# EAGLE design W103C (EAGLE 6.6.0)
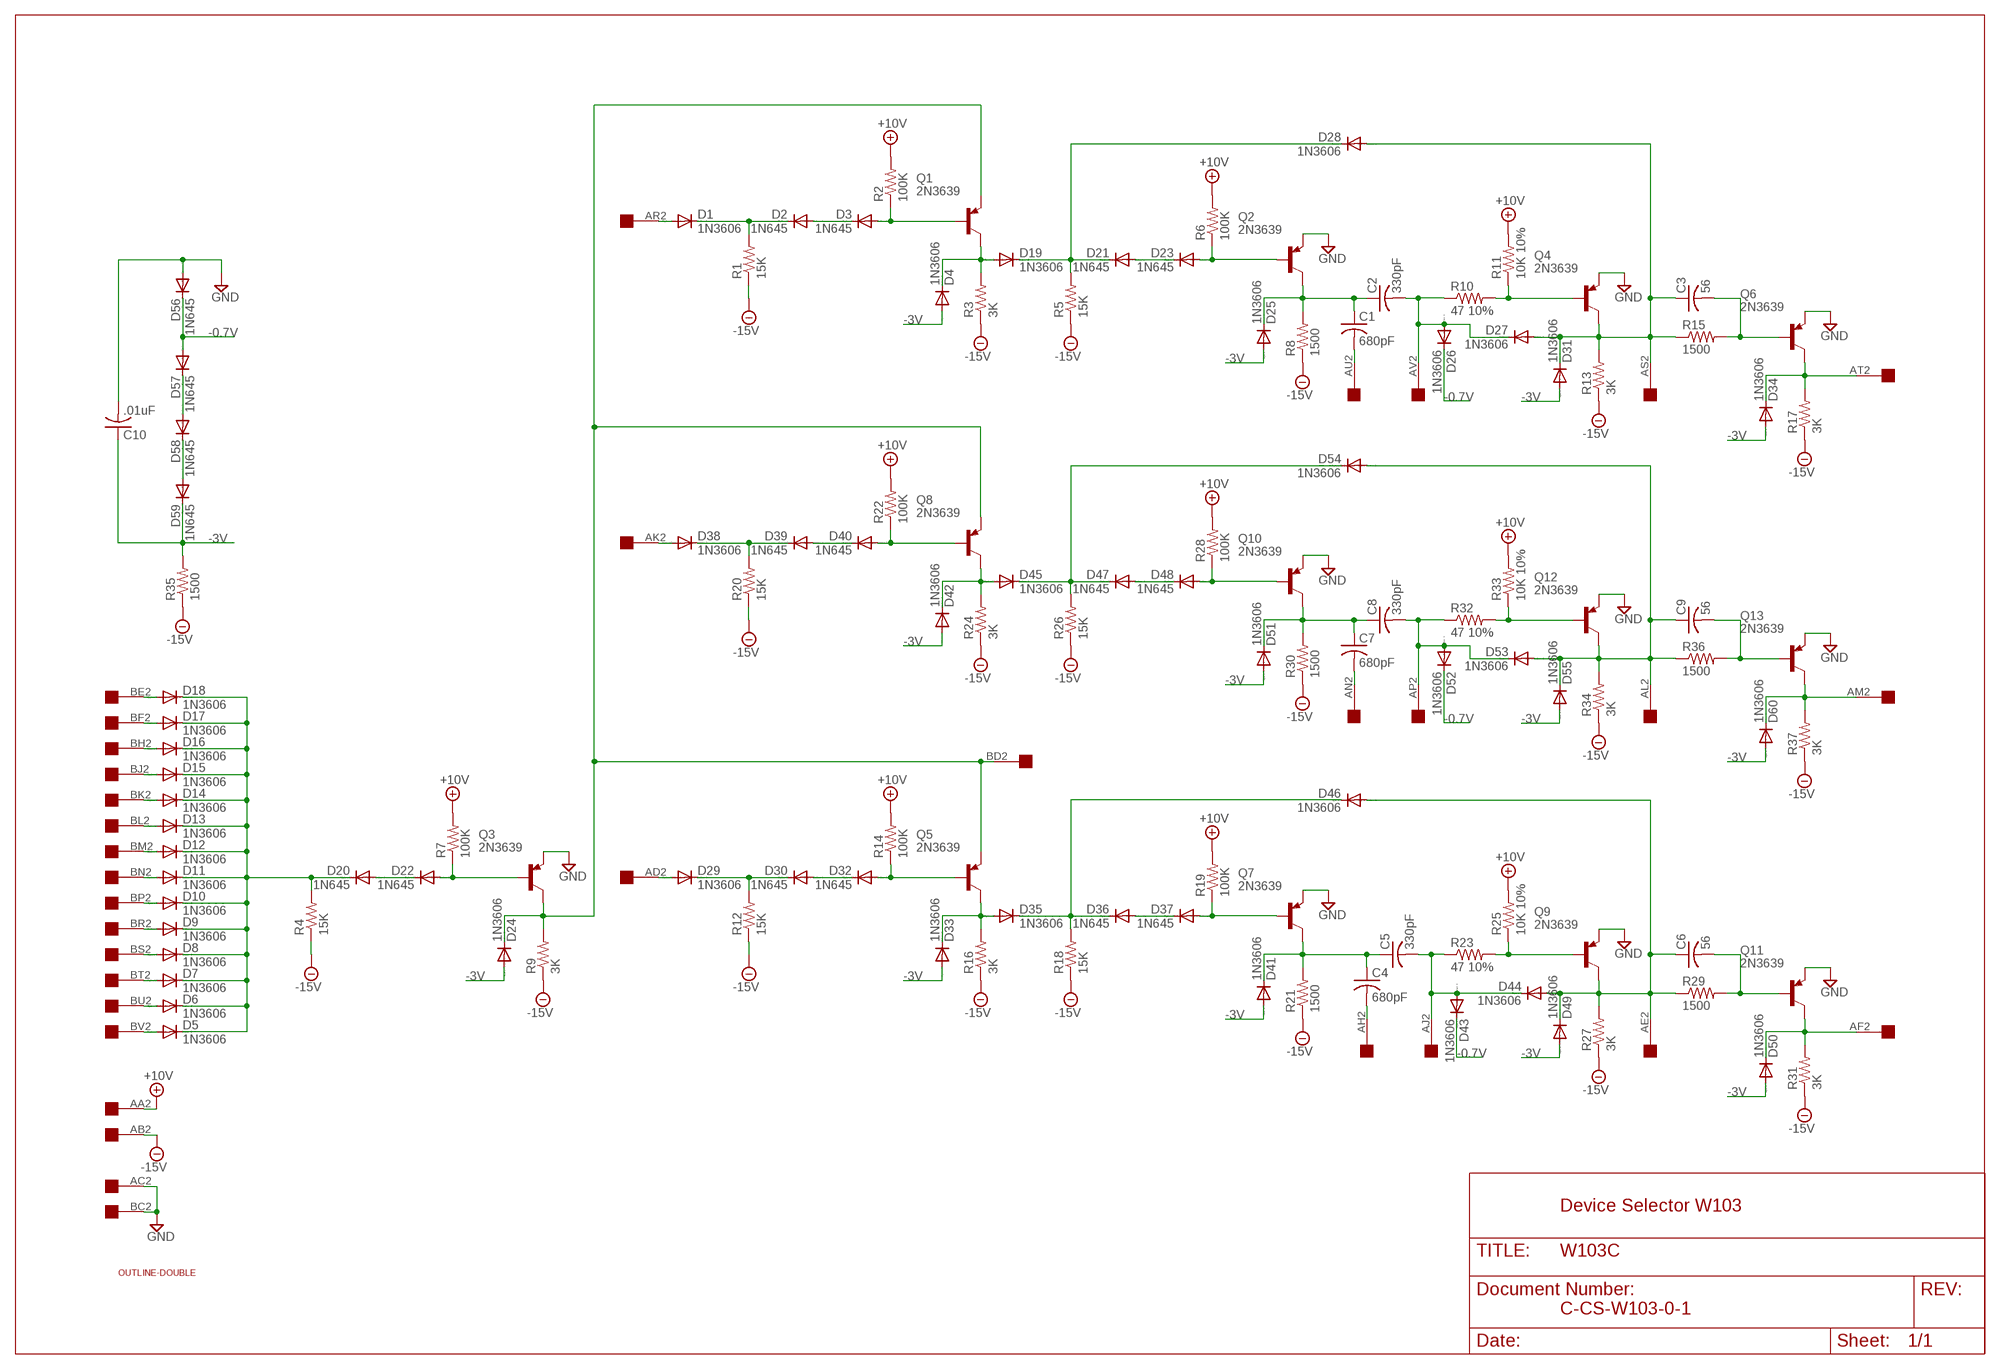
[diagram p0: schematic, sheet 1]

## Parts
C1  680pF  C-US075-032X103  [C075-032X103]
C2  330pF  C-US075-032X103  [C075-032X103]
C3  56  C-US075-032X103  [C075-032X103]
C4  680pF  C-US075-032X103  [C075-032X103]
C5  330pF  C-US075-032X103  [C075-032X103]
C6  56  C-US075-032X103  [C075-032X103]
C7  680pF  C-US075-032X103  [C075-032X103]
C8  330pF  C-US075-032X103  [C075-032X103]
C9  56  C-US075-032X103  [C075-032X103]
C10  .01uF  C-US075-032X103  [C075-032X103]
D1  1N3606  1N4148DO35-10  [DO35-10]
D2  1N645  1N4148DO35-10  [DO35-10]
D3  1N645  1N4148DO35-10  [DO35-10]
D4  1N3606  1N4148DO35-10  [DO35-10]
D5  1N3606  1N4148DO35-10  [DO35-10]
D6  1N3606  1N4148DO35-10  [DO35-10]
D7  1N3606  1N4148DO35-10  [DO35-10]
D8  1N3606  1N4148DO35-10  [DO35-10]
D9  1N3606  1N4148DO35-10  [DO35-10]
D10  1N3606  1N4148DO35-10  [DO35-10]
D11  1N3606  1N4148DO35-10  [DO35-10]
D12  1N3606  1N4148DO35-10  [DO35-10]
D13  1N3606  1N4148DO35-10  [DO35-10]
D14  1N3606  1N4148DO35-10  [DO35-10]
D15  1N3606  1N4148DO35-10  [DO35-10]
D16  1N3606  1N4148DO35-10  [DO35-10]
D17  1N3606  1N4148DO35-10  [DO35-10]
D18  1N3606  1N4148DO35-10  [DO35-10]
D19  1N3606  1N4148DO35-10  [DO35-10]
D20  1N645  1N4148DO35-10  [DO35-10]
D21  1N645  1N4148DO35-10  [DO35-10]
D22  1N645  1N4148DO35-10  [DO35-10]
D23  1N645  1N4148DO35-10  [DO35-10]
D24  1N3606  1N4148DO35-10  [DO35-10]
D25  1N3606  1N4148DO35-10  [DO35-10]
D26  1N3606  1N4148DO35-10  [DO35-10]
D27  1N3606  1N4148DO35-10  [DO35-10]
D28  1N3606  1N4148DO35-10  [DO35-10]
D29  1N3606  1N4148DO35-10  [DO35-10]
D30  1N645  1N4148DO35-10  [DO35-10]
D31  1N3606  1N4148DO35-10  [DO35-10]
D32  1N645  1N4148DO35-10  [DO35-10]
D33  1N3606  1N4148DO35-10  [DO35-10]
D34  1N3606  1N4148DO35-10  [DO35-10]
D35  1N3606  1N4148DO35-10  [DO35-10]
D36  1N645  1N4148DO35-10  [DO35-10]
D37  1N645  1N4148DO35-10  [DO35-10]
D38  1N3606  1N4148DO35-10  [DO35-10]
D39  1N645  1N4148DO35-10  [DO35-10]
D40  1N645  1N4148DO35-10  [DO35-10]
D41  1N3606  1N4148DO35-10  [DO35-10]
D42  1N3606  1N4148DO35-10  [DO35-10]
D43  1N3606  1N4148DO35-10  [DO35-10]
D44  1N3606  1N4148DO35-10  [DO35-10]
D45  1N3606  1N4148DO35-10  [DO35-10]
D46  1N3606  1N4148DO35-10  [DO35-10]
D47  1N645  1N4148DO35-10  [DO35-10]
D48  1N645  1N4148DO35-10  [DO35-10]
D49  1N3606  1N4148DO35-10  [DO35-10]
D50  1N3606  1N4148DO35-10  [DO35-10]
D51  1N3606  1N4148DO35-10  [DO35-10]
D52  1N3606  1N4148DO35-10  [DO35-10]
D53  1N3606  1N4148DO35-10  [DO35-10]
D54  1N3606  1N4148DO35-10  [DO35-10]
D55  1N3606  1N4148DO35-10  [DO35-10]
D56  1N645  1N4148DO35-10  [DO35-10]
D57  1N645  1N4148DO35-10  [DO35-10]
D58  1N645  1N4148DO35-10  [DO35-10]
D59  1N645  1N4148DO35-10  [DO35-10]
D60  1N3606  1N4148DO35-10  [DO35-10]
Q1  2N3639  2N2904  [TO39]
Q2  2N3639  2N2904  [TO39]
Q3  2N3639  2N2904  [TO39]
Q4  2N3639  2N2904  [TO39]
Q5  2N3639  2N2904  [TO39]
Q6  2N3639  2N2904  [TO39]
Q7  2N3639  2N2904  [TO39]
Q8  2N3639  2N2904  [TO39]
Q9  2N3639  2N2904  [TO39]
Q10  2N3639  2N2904  [TO39]
Q11  2N3639  2N2904  [TO39]
Q12  2N3639  2N2904  [TO39]
Q13  2N3639  2N2904  [TO39]
R1  15K  R-US_0207/10  [0207/10]
R2  100K  R-US_0207/10  [0207/10]
R3  3K  R-US_0207/10  [0207/10]
R4  15K  R-US_0207/10  [0207/10]
R5  15K  R-US_0207/10  [0207/10]
R6  100K  R-US_0207/10  [0207/10]
R7  100K  R-US_0207/10  [0207/10]
R8  1500  R-US_0207/10  [0207/10]
R9  3K  R-US_0207/10  [0207/10]
R10  47 10%  R-US_0207/10  [0207/10]
R11  10K 10%  R-US_0207/10  [0207/10]
R12  15K  R-US_0207/10  [0207/10]
R13  3K  R-US_0207/10  [0207/10]
R14  100K  R-US_0207/10  [0207/10]
R15  1500  R-US_0207/10  [0207/10]
R16  3K  R-US_0207/10  [0207/10]
R17  3K  R-US_0207/10  [0207/10]
R18  15K  R-US_0207/10  [0207/10]
R19  100K  R-US_0207/10  [0207/10]
R20  15K  R-US_0207/10  [0207/10]
R21  1500  R-US_0207/10  [0207/10]
R22  100K  R-US_0207/10  [0207/10]
R23  47 10%  R-US_0207/10  [0207/10]
R24  3K  R-US_0207/10  [0207/10]
R25  10K 10%  R-US_0207/10  [0207/10]
R26  15K  R-US_0207/10  [0207/10]
R27  3K  R-US_0207/10  [0207/10]
R28  100K  R-US_0207/10  [0207/10]
R29  1500  R-US_0207/10  [0207/10]
R30  1500  R-US_0207/10  [0207/10]
R31  3K  R-US_0207/10  [0207/10]
R32  47 10%  R-US_0207/10  [0207/10]
R33  10K 10%  R-US_0207/10  [0207/10]
R34  3K  R-US_0207/10  [0207/10]
R35  1500  R-US_0207/10  [0207/10]
R36  1500  R-US_0207/10  [0207/10]
R37  3K  R-US_0207/10  [0207/10]
U$1  OUTLINE-DOUBLE  [DOUBLE]
U$2  DOUBLE  [EDGE-CON4]

## Nets
+10V [Supply]: R2.2 R6.2 R7.2 R11.2 R14.2 R19.2 R22.2 R25.2 R28.2 R33.2 U$2.AA2
-0.7V [Supply]: D26.C D43.C D52.C D56.C D57.A
-3V [Supply]: C10.1 D4.A D24.A D25.A D31.A D33.A D34.A D41.A D42.A D49.A D50.A D51.A D55.A D59.C D60.A R35.2
-15V [Supply]: R1.1 R3.1 R4.1 R5.1 R8.1 R9.1 R12.1 R13.1 R16.1 R17.1 R18.1 R20.1 R21.1 R24.1 R26.1 R27.1 R30.1 R31.1 R34.1 R35.1 R37.1 U$2.AB2
GND [Supply]: C10.2 D56.A Q2.1(E) Q3.1(E) Q4.1(E) Q6.1(E) Q7.1(E) Q9.1(E) Q10.1(E) Q11.1(E) Q12.1(E) Q13.1(E) U$2.AC2 U$2.BC2
N$1: D14.A U$2.BK2
N$2: D15.A U$2.BJ2
N$3: D16.A U$2.BH2
N$4: D17.A U$2.BF2
N$5: D18.A U$2.BE2
N$6: D13.A U$2.BL2
N$7: D5.A U$2.BV2
N$8: D6.A U$2.BU2
N$9: D7.A U$2.BT2
N$10: D8.A U$2.BS2
N$11: D9.A U$2.BR2
N$12: D10.A U$2.BP2
N$13: D11.A U$2.BN2
N$14: D12.A U$2.BM2
N$15: D5.C D6.C D7.C D8.C D9.C D10.C D11.C D12.C D13.C D14.C D15.C D16.C D17.C D18.C D20.C R4.2
N$16: D20.A D22.C
N$17: D22.A Q3.2(B) R7.1
N$18: D24.C Q1.1(E) Q3.3(C) Q5.1(E) Q8.1(E) R9.2 U$2.BD2
N$19: D29.A U$2.AD2
N$20: D29.C D30.C R12.2
N$21: D30.A D32.C
N$22: D32.A Q5.2(B) R14.1
N$23: D33.C D35.A Q5.3(C) R16.2
N$24: D1.A U$2.AR2
N$25: D35.C D36.C D46.C R18.2
N$26: D36.A D37.C
N$27: D37.A Q7.2(B) R19.1
N$28: C4.1 C5.1 D41.C Q7.3(C) R21.2
N$29: C4.2 U$2.AH2
N$30: C5.2 D43.A D44.C R23.1 U$2.AJ2
N$31: Q9.2(B) R23.2 R25.1
N$32: C6.1 D44.A D46.A D49.C Q9.3(C) R27.2 R29.1 U$2.AE2
N$33: C6.2 Q11.2(B) R29.2
N$34: D50.C Q11.3(C) R31.2 U$2.AF2
N$35: D1.C D2.C R1.2
N$36: D2.A D3.C
N$37: D3.A Q1.2(B) R2.1
N$38: D4.C D19.A Q1.3(C) R3.2
N$39: D19.C D21.C D28.C R5.2
N$40: D21.A D23.C
N$41: D23.A Q2.2(B) R6.1
N$42: C1.1 C2.1 D25.C Q2.3(C) R8.2
N$43: D38.A U$2.AK2
N$44: C1.2 U$2.AU2
N$45: C2.2 D26.A D27.C R10.1 U$2.AV2
N$46: Q4.2(B) R10.2 R11.1
N$47: C3.1 D27.A D28.A D31.C Q4.3(C) R13.2 R15.1 U$2.AS2
N$48: C3.2 Q6.2(B) R15.2
N$49: D34.C Q6.3(C) R17.2 U$2.AT2
N$50: D38.C D39.C R20.2
N$51: D39.A D40.C
N$52: D40.A Q8.2(B) R22.1
N$53: D42.C D45.A Q8.3(C) R24.2
N$54: D45.C D47.C D54.C R26.2
N$55: D47.A D48.C
N$56: D48.A Q10.2(B) R28.1
N$57: C7.1 C8.1 D51.C Q10.3(C) R30.2
N$58: C7.2 U$2.AN2
N$59: C8.2 D52.A D53.C R32.1 U$2.AP2
N$60: Q12.2(B) R32.2 R33.1
N$61: C9.1 D53.A D54.A D55.C Q12.3(C) R34.2 R36.1 U$2.AL2
N$62: C9.2 Q13.2(B) R36.2
N$63: D60.C Q13.3(C) R37.2 U$2.AM2
N$65 [Supply]: D58.C D59.A
N$66 [Supply]: D57.C D58.A
Unconnected: U$2.AA1 U$2.AB1 U$2.AC1 U$2.AD1 U$2.AE1 U$2.AF1 U$2.AH1 U$2.AJ1 U$2.AK1 U$2.AL1 U$2.AM1 U$2.AN1 U$2.AP1 U$2.AR1 U$2.AS1 U$2.AT1 U$2.AU1 U$2.AV1 U$2.BA1 U$2.BA2 U$2.BB1 U$2.BB2 U$2.BC1 U$2.BD1 U$2.BE1 U$2.BF1 U$2.BH1 U$2.BJ1 U$2.BK1 U$2.BL1 U$2.BM1 U$2.BN1 U$2.BP1 U$2.BR1 U$2.BS1 U$2.BT1 U$2.BU1 U$2.BV1

## Notes on the sheet
- Device Selector W103
- C-CS-W103-0-1

## Library data of the parts
C1-C10 = rcl:C-US: CAPACITOR, American symbol
D1-D60 = diode:1N4148: DIODE high speed (Philips)
Q1-Q13 = transistor-pnp:2N2904*: PNP Transistror
R1-R37 = rcl:R-US_: RESISTOR, American symbol
U$1 = dec-con:OUTLINE-*: Board outlines for DEC boards.
U$2 = dec-con:DOUBLE: Double-Height DEC board

## Net classes
1 Supply: width 0.813 mm

## Board
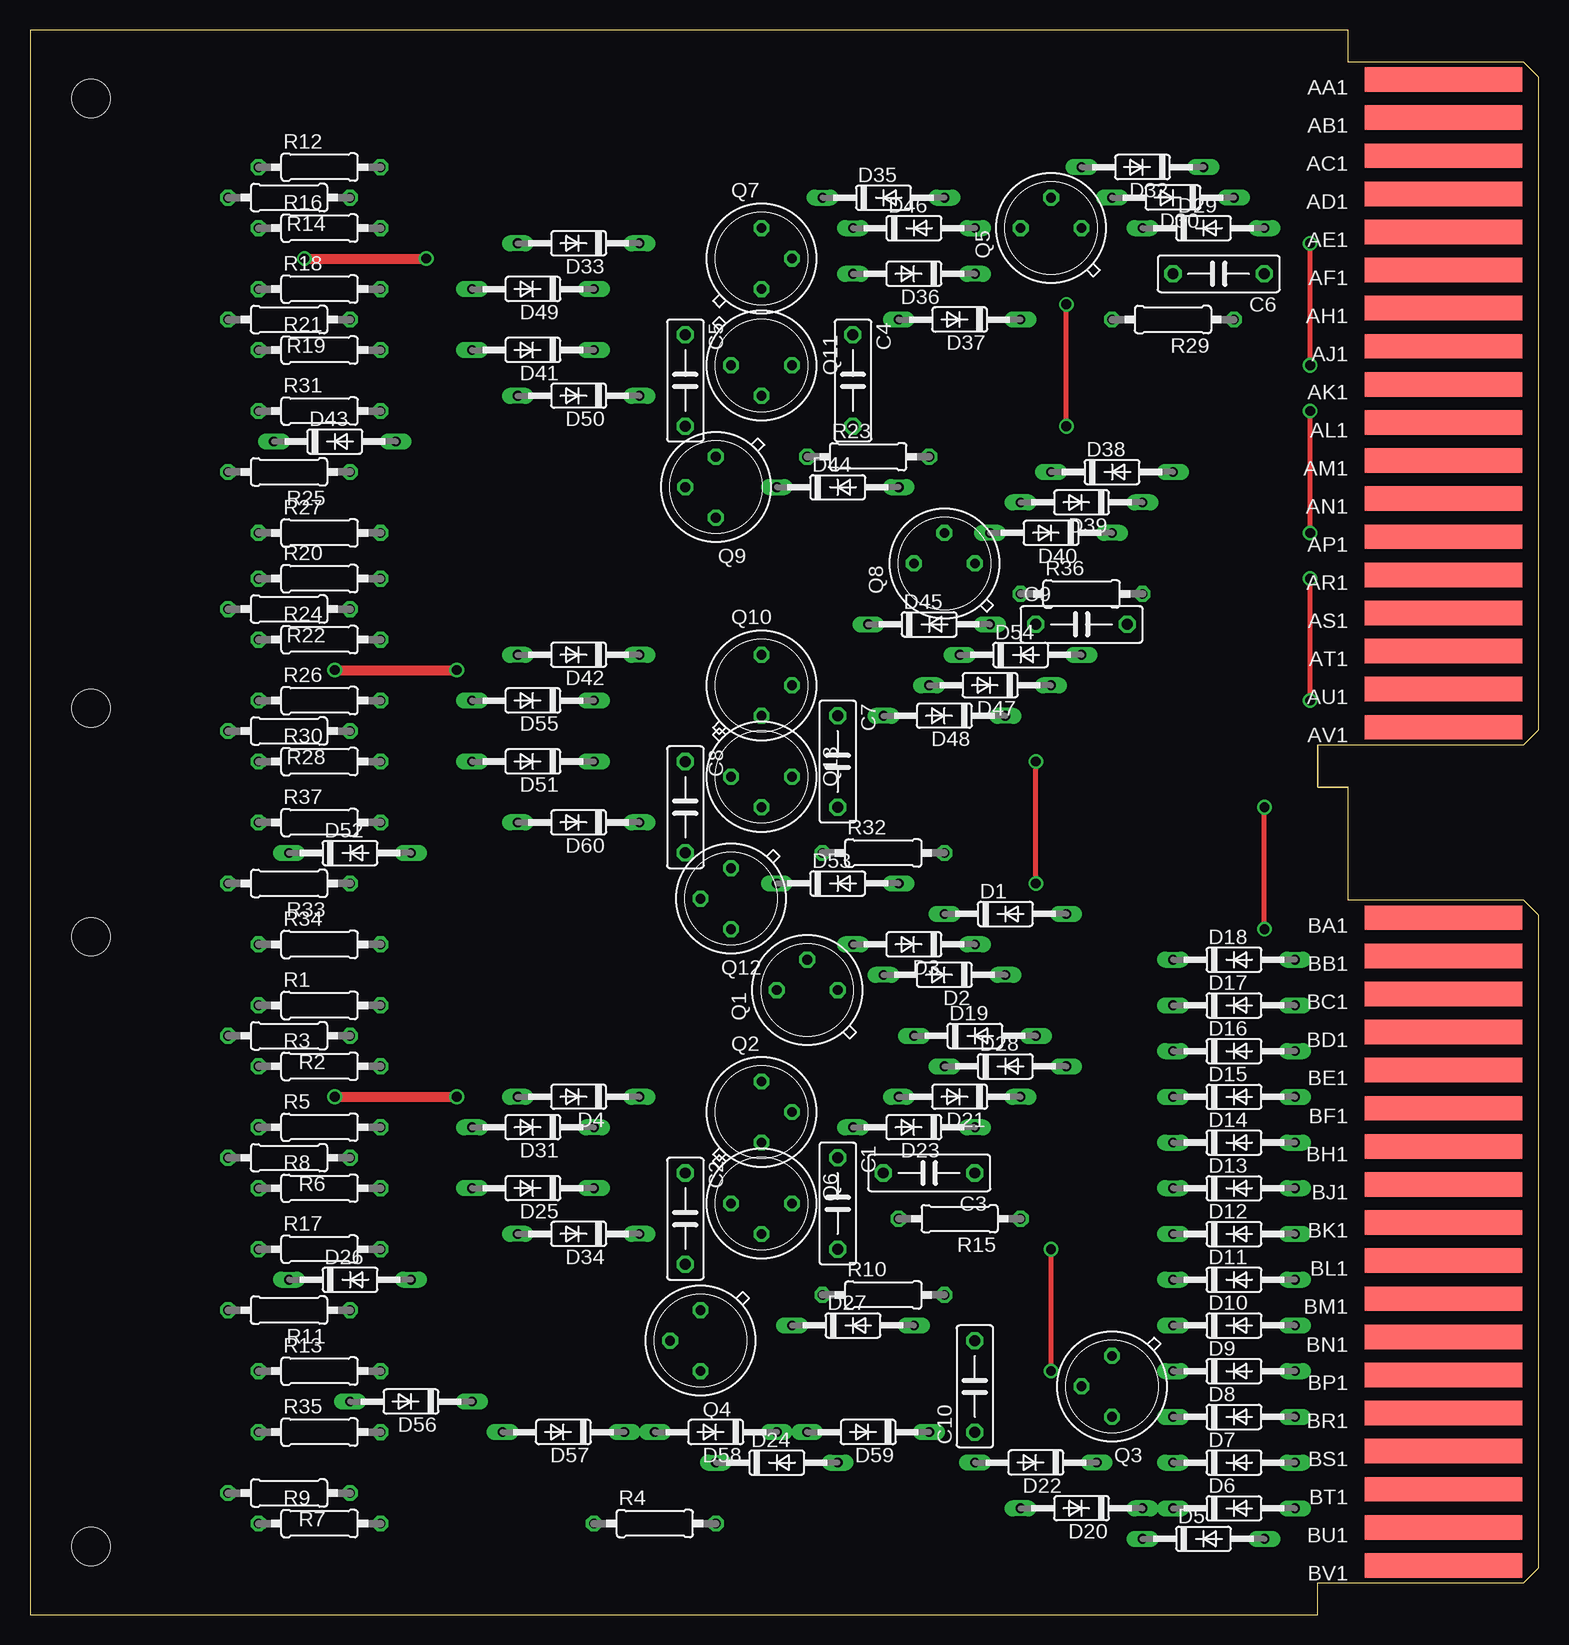
[diagram p1: board, top side]
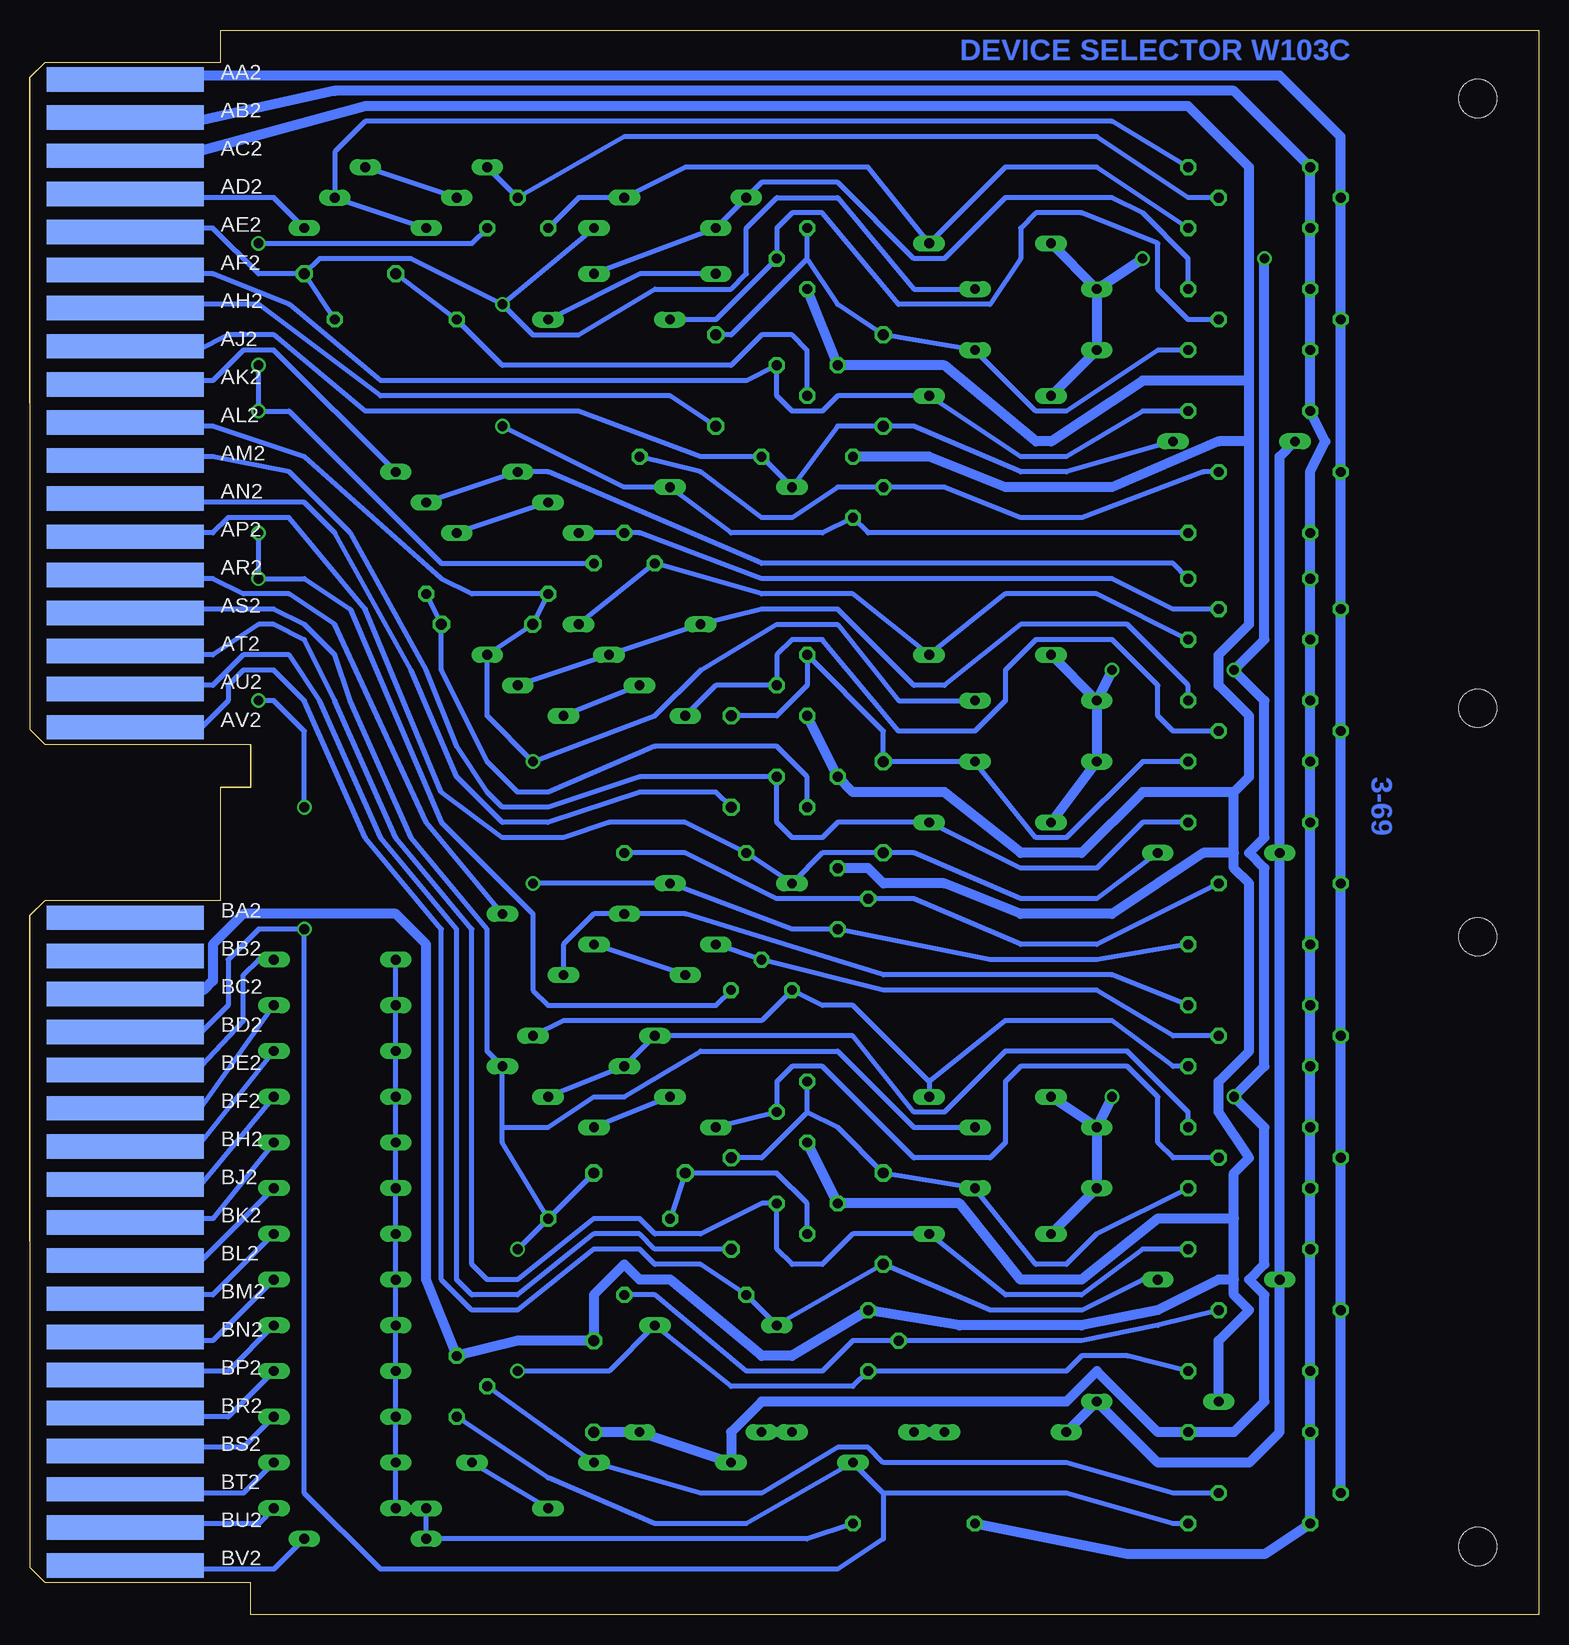
[diagram p2: board, bottom side, seen from below]

Size 125.73 x 132.08 mm. Coordinates in mm from the lower left corner, seen from the top.
Copper layers (1+16): Top 0.035mm / dielectric 1.5mm / Bottom 0.035mm
Design rules "16mils": minimum track width 16mil, minimum drill 32mil, track to track 15mil, track to pad 10mil, pad to pad 10mil, via to via 10mil, smd to smd 10mil, copper to edge 13mil, drill to drill 10mil, minimum pad ring 10mil, minimum via ring 8mil, stop-mask expansion 0mil, vias tented up to drill 0mil, thermal gap 10mil
vRestrict: area 31.8,108 to 41.9,125.7; area 49.5,108 to 59.7,125.7; area 67.3,108 to 77.5,125.7; area 85.1,108 to 95.2,125.7; area 102.9,108 to 113,125.7; area 31.8,80 to 41.9,97.8; area 49.5,80 to 59.7,97.8; area 67.3,80 to 77.5,97.8; area 85.1,80 to 95.2,97.8; area 31.8,34.3 to 41.9,52.1; area 49.5,34.3 to 59.7,52.1; area 67.3,34.3 to 77.5,52.1; area 85.1,34.3 to 95.2,52.1; area 102.9,11.4 to 113,29.2; area 85.1,11.4 to 95.2,29.2; area 49.5,11.4 to 59.7,29.2; area 31.8,11.4 to 41.9,29.2; area 67.3,11.4 to 77.5,29.2

### Footprints (pad centres in the part's own frame; a part is rotated, then mirrored left to right if it is on the bottom)
C075-032X103 = drill 0.914 octagon: 1 -3.81,0; 2 3.81,0
DO35-10 = drill 0.813 long: A 5.08,0; C -5.08,0
TO39 = drill 0.813 octagon: 1 0,-2.54; 2 2.54,0; 3 0,2.54
0207/10 = drill 0.813 octagon: 1 -5.08,0; 2 5.08,0
DOUBLE = hole 3.175: 120.65,56.515; 120.65,5.715; 120.65,75.565; 120.65,126.365
EDGE-CON4 = smd 13.106 x 2.032: AA1 7.938,4.128; AB1 7.938,7.303; AC1 7.938,10.477; AD1 7.938,13.652; AE1 7.938,16.828; AF1 7.938,20.003; AH1 7.938,23.177; AJ1 7.938,26.352; AK1 7.938,29.527; AL1 7.938,32.703; AM1 7.938,35.877; AN1 7.938,39.053; AP1 7.938,42.227; AR1 7.938,45.403; AS1 7.938,48.578; AT1 7.938,51.752; AU1 7.938,54.928; AV1 7.938,58.102; BA1 7.938,73.978; BB1 7.938,77.153; BC1 7.938,80.328; BD1 7.938,83.502; BE1 7.938,86.677; BF1 7.938,89.853; BH1 7.938,93.028; BJ1 7.938,96.203; BK1 7.938,99.377; BL1 7.938,102.552; BM1 7.938,105.728; BN1 7.938,108.903; BP1 7.938,112.078; BR1 7.938,115.252; BS1 7.938,118.427; BT1 7.938,121.603; BU1 7.938,124.778; BV1 7.938,127.953 | smd 13.106 x 2.032 bottom: AA2 7.938,4.128; AB2 7.938,7.303; AC2 7.938,10.477; AD2 7.938,13.652; AE2 7.938,16.828; AF2 7.938,20.003; AH2 7.938,23.177; AJ2 7.938,26.352; AK2 7.938,29.527; AL2 7.938,32.703; AM2 7.938,35.877; AN2 7.938,39.053; AP2 7.938,42.227; AR2 7.938,45.403; AS2 7.938,48.578; AT2 7.938,51.752; AU2 7.938,54.928; AV2 7.938,58.102; BA2 7.938,73.978; BB2 7.938,77.153; BC2 7.938,80.328; BD2 7.938,83.502; BE2 7.938,86.677; BF2 7.938,89.853; BH2 7.938,93.028; BJ2 7.938,96.203; BK2 7.938,99.377; BL2 7.938,102.552; BM2 7.938,105.728; BN2 7.938,108.903; BP2 7.938,112.078; BR2 7.938,115.252; BS2 7.938,118.427; BT2 7.938,121.603; BU2 7.938,124.778; BV2 7.938,127.953

### Placement (x,y rotation side)
C1  67.31,34.29 270 top
C2  54.61,33.02 270 top
C3  74.93,36.83 180 top
C4  68.58,102.87 270 top
C5  54.61,102.87 270 top
C6  99.06,111.76 180 top
C7  67.31,71.12 270 top
C8  54.61,67.31 270 top
C9  87.63,82.55 0 top
C10  78.74,19.05 90 top
D1  81.28,58.42 0 top
D2  76.2,53.34 180 top
D3  73.66,55.88 180 top
D4  45.72,43.18 180 top
D5  97.79,6.35 0 top
D6  100.33,8.89 0 top
D7  100.33,12.7 0 top
D8  100.33,16.51 0 top
D9  100.33,20.32 0 top
D10  100.33,24.13 0 top
D11  100.33,27.94 0 top
D12  100.33,31.75 0 top
D13  100.33,35.56 0 top
D14  100.33,39.37 0 top
D15  100.33,43.18 0 top
D16  100.33,46.99 0 top
D17  100.33,50.8 0 top
D18  100.33,54.61 0 top
D19  78.74,48.26 0 top
D20  87.63,8.89 180 top
D21  77.47,43.18 180 top
D22  83.82,12.7 180 top
D23  73.66,40.64 180 top
D24  62.23,12.7 0 top
D25  41.91,35.56 180 top
D26  26.67,27.94 0 top
D27  68.58,24.13 0 top
D28  81.28,45.72 0 top
D29  97.79,115.57 0 top
D30  95.25,118.11 180 top
D31  41.91,40.64 180 top
D32  92.71,120.65 180 top
D33  45.72,114.3 180 top
D34  45.72,31.75 180 top
D35  71.12,118.11 0 top
D36  73.66,111.76 180 top
D37  77.47,107.95 180 top
D38  90.17,95.25 0 top
D39  87.63,92.71 180 top
D40  85.09,90.17 180 top
D41  41.91,105.41 180 top
D42  45.72,80.01 180 top
D43  25.4,97.79 0 top
D44  67.31,93.98 0 top
D45  74.93,82.55 0 top
D46  73.66,115.57 0 top
D47  80.01,77.47 180 top
D48  76.2,74.93 180 top
D49  41.91,110.49 180 top
D50  45.72,101.6 180 top
D51  41.91,71.12 180 top
D52  26.67,63.5 0 top
D53  67.31,60.96 0 top
D54  82.55,80.01 0 top
D55  41.91,76.2 180 top
D56  31.75,17.78 180 top
D57  44.45,15.24 180 top
D58  57.15,15.24 180 top
D59  69.85,15.24 180 top
D60  45.72,66.04 180 top
Q1  64.77,52.07 90 top
Q2  60.96,41.91 0 top
Q3  90.17,19.05 180 top
Q4  55.88,22.86 180 top
Q5  85.09,115.57 90 top
Q6  60.96,34.29 270 top
Q7  60.96,113.03 0 top
Q8  76.2,87.63 90 top
Q9  57.15,93.98 180 top
Q10  60.96,77.47 0 top
Q11  60.96,104.14 270 top
Q12  58.42,59.69 180 top
Q13  60.96,69.85 270 top
R1  24.13,50.8 0 top
R2  21.59,48.26 180 top
R3  24.13,45.72 0 top
R4  52.07,7.62 0 top
R5  24.13,40.64 0 top
R6  21.59,38.1 180 top
R7  21.59,10.16 180 top
R8  24.13,35.56 0 top
R9  24.13,7.62 0 top
R10  71.12,26.67 0 top
R11  21.59,25.4 180 top
R12  24.13,120.65 0 top
R13  24.13,20.32 0 top
R14  21.59,118.11 180 top
R15  77.47,33.02 180 top
R16  24.13,115.57 0 top
R17  24.13,30.48 0 top
R18  24.13,110.49 0 top
R19  21.59,107.95 180 top
R20  24.13,86.36 0 top
R21  24.13,105.41 0 top
R22  21.59,83.82 180 top
R23  69.85,96.52 0 top
R24  24.13,81.28 0 top
R25  21.59,95.25 180 top
R26  24.13,76.2 0 top
R27  24.13,90.17 0 top
R28  21.59,73.66 180 top
R29  95.25,107.95 180 top
R30  24.13,71.12 0 top
R31  24.13,100.33 0 top
R32  71.12,63.5 0 top
R33  21.59,60.96 180 top
R34  24.13,55.88 0 top
R35  24.13,15.24 0 top
R36  87.63,85.09 0 top
R37  24.13,66.04 0 top
U$1  125.73,132.08 180 top
U$2  125.73,132.08 180 top

### Tracks (layer width: path | path; a pad name or v marks a point on that pad's centre or on a via)
+10V
  Bottom 0.813: U$2.AA2 117.24,127.87 116.84,128.27 21.59,128.27 16.51,123.19 R14.2 R19.2 R25.2 R22.2 R28.2 R33.2 R2.2 R6.2 R11.2 R7.2
-0.7V
  Bottom 0.813: D43.C 21.59,96.52 D52.C D26.C 21.59,15.24 24.13,12.7 31.75,12.7 D56.C D57.A
-3V  (via drill 0.81)
  Top 0.813: v22.86,113.03 v33.02,113.03 | v25.4,78.74 v35.56,78.74 | v25.4,43.18 v35.56,43.18
  Bottom 0.813: D49.A D33.A | D49.A D41.A D50.A | v33.02,113.03 D49.A | v22.86,113.03 22.86,81.28 v25.4,78.74 22.86,76.2 22.86,64.77 24.13,63.5 22.86,62.23 22.86,45.72 v25.4,43.18 22.86,40.64 22.86,29.21 24.13,27.94 22.86,26.67 22.86,17.78 25.4,15.24 R35.2 31.75,15.24 36.83,20.32 39.37,17.78 64.77,17.78 67.31,15.24 D24.A D59.C C10.1 | v35.56,78.74 D55.A | D55.A D42.A | D60.A D51.A D55.A | D31.A D4.A | v35.56,43.18 D31.A | D31.A D25.A D34.A
-15V
  Bottom 0.813: R4.1 34.29,5.08 22.86,5.08 R9.1 R35.1 R13.1 R17.1 R8.1 R5.1 R3.1 R1.1 R34.1 R37.1 R30.1 R26.1 R24.1 R20.1 R27.1 19.05,95.25 17.78,97.79 R31.1 R21.1 R18.1 R16.1 R12.1 25.4,127 100.33,127 111.76,124.46 116.84,124.46 117.13,124.75 U$2.AB2
GND
  Bottom 0.813: U$2.BC2 117.17,51.74 116.84,52.07 111.25,52.07 110.49,52.83 110.49,55.88 107.95,58.42 95.25,58.42 92.71,55.88 92.71,27.94 Q3.1 85.09,22.86 C10.2 78.74,26.67 76.2,29.21 74.93,27.94 72.39,27.94 64.77,21.59 62.23,21.59 Q4.1 48.26,24.13 38.1,24.13 31.75,25.4 26.67,27.94 25.4,27.94 | U$2.AC2 117.17,121.59 116.84,121.92 111.76,121.92 97.79,125.73 29.21,125.73 24.13,120.65 24.13,102.87 | Q7.1 Q11.1 49.53,104.14 41.91,97.79 40.64,97.79 33.02,102.87 24.13,102.87 | 24.13,97.79 26.67,97.79 35.56,93.98 44.45,93.98 50.8,96.52 Q9.1 | 24.13,97.79 24.13,102.87 | 25.4,27.94 25.4,33.02 | 25.4,33.02 25.4,36.83 24.13,38.1 26.67,41.91 26.67,44.45 24.13,46.99 24.13,60.96 25.4,62.23 25.4,63.5 | 25.4,63.5 25.4,68.58 | 25.4,68.58 24.13,69.85 24.13,74.93 26.67,77.47 26.67,80.01 24.13,82.55 24.13,97.79 | D56.A 26.67,22.86 24.13,25.4 25.4,26.67 25.4,27.94 | Q2.1 Q6.1 48.26,34.29 43.18,27.94 38.1,27.94 31.75,33.02 25.4,33.02 | 25.4,68.58 33.02,68.58 38.1,63.5 43.18,63.5 49.53,68.58 57.15,68.58 Q13.1 Q10.1 | Q12.1 55.88,62.23 54.61,60.96 49.53,60.96 43.18,58.42 35.56,58.42 27.94,63.5 25.4,63.5
N$1
  Bottom 0.406: U$2.BK2 117.14,32.72 116.84,33.02 110.49,33.02 D14.A
N$2
  Bottom 0.406: U$2.BJ2 117.17,35.89 116.84,35.56 111.76,35.56 D15.A
N$3
  Bottom 0.406: U$2.BH2 117.17,39.04 116.84,39.37 111.51,39.37 D16.A
N$4
  Bottom 0.406: U$2.BF2 117.12,42.19 116.84,41.91 111.76,41.91 D17.A
N$5
  Bottom 0.406: U$2.BE2 117.17,45.39 116.84,45.72 111.51,45.72 107.95,49.53 107.95,53.34 106.68,54.61 D18.A
N$6
  Bottom 0.406: U$2.BL2 117.17,29.54 116.84,29.21 111.76,29.21 D13.A
N$7
  Bottom 0.406: U$2.BV2 117.23,4.2 116.84,3.81 105.41,3.81 D5.A
N$8
  Bottom 0.406: U$2.BU2 117.2,7.26 116.84,7.62 106.68,7.62 D6.A
N$9
  Bottom 0.406: U$2.BT2 117.17,10.49 116.84,10.16 107.95,10.16 D7.A
N$10
  Bottom 0.406: U$2.BS2 117.14,13.66 116.84,13.97 107.95,13.97 D8.A
N$11
  Bottom 0.406: U$2.BR2 117.17,16.84 116.84,16.51 109.22,16.51 D9.A
N$12
  Bottom 0.406: U$2.BP2 117.17,19.99 116.84,20.32 109.22,20.32 D10.A
N$13
  Bottom 0.406: U$2.BN2 117.17,23.19 116.84,22.86 110.49,22.86 D11.A
N$14
  Bottom 0.406: U$2.BM2 117.17,26.34 116.84,26.67 110.49,26.67 D12.A
N$15
  Bottom 0.406: D18.C D17.C D16.C D15.C D14.C D13.C D12.C D11.C D10.C D9.C D8.C D7.C D6.C D20.C D5.C 60.96,6.35 R4.2
N$16
  Bottom 0.406: D20.A D22.C
N$17
  Bottom 0.406: R7.1 30.48,10.16 39.37,12.7 54.61,12.7 55.88,13.97 58.42,13.97 64.77,10.16 69.85,10.16 D22.A Q3.2
N$18  (via drill 0.81)
  Top 0.406: v102.87,57.15 v102.87,67.31 | v106.68,76.2 v106.68,86.36 | v106.68,90.17 v106.68,100.33 | v106.68,104.14 v106.68,114.3
  Bottom 0.406: Q3.3 82.55,11.43 73.66,7.62 66.04,7.62 D24.C 54.61,10.16 | U$2.BD2 117.14,48.56 116.84,48.26 111.76,48.26 109.22,50.8 109.22,54.61 106.68,57.15 v102.87,57.15 102.87,10.16 96.52,3.81 58.42,3.81 54.61,6.35 54.61,10.16 | v102.87,67.31 102.87,73.66 105.41,76.2 v106.68,76.2 | v106.68,104.14 v106.68,100.33 104.14,100.33 91.44,87.63 Q8.1 | v106.68,90.17 v106.68,86.36 102.87,86.36 99.06,83.82 91.44,66.04 83.82,58.42 83.82,52.07 82.55,50.8 68.58,50.8 Q1.1 | v106.68,114.3 88.9,114.3 Q5.1 | R9.2 30.48,7.62 39.37,10.16 54.61,10.16
N$19
  Bottom 0.406: U$2.AD2 117.14,118.42 116.84,118.11 105.41,118.11 D29.A
N$20
  Bottom 0.406: R12.2 35.56,124.46 97.79,124.46 100.33,121.92 D30.C D29.C
N$21
  Bottom 0.406: D30.A D32.C
N$22
  Bottom 0.406: D32.A Q5.2 76.2,123.19 36.83,123.19 29.21,118.11 R14.1
N$23
  Bottom 0.406: R16.2 36.83,120.65 44.45,120.65 D33.C 55.88,120.65 71.12,120.65 D35.A 80.01,118.11 Q5.3
N$24
  Bottom 0.406: U$2.AR2 116.84,86.36 110.49,86.36 107.95,85.09 104.14,85.09 100.33,82.55 92.71,66.04 D1.A
N$25
  Bottom 0.406: D36.C D46.C D35.C 64.77,119.38 58.42,119.38 52.07,113.03 49.53,113.03 44.45,118.11 35.56,118.11 33.02,116.84 29.21,113.03 R18.2
N$26
  Bottom 0.406: D36.A 74.93,111.76 D37.C
N$27
  Bottom 0.406: D37.A 68.58,107.95 Q7.2 63.5,115.57 62.23,116.84 59.69,116.84 53.34,109.22 45.72,109.22 43.18,113.03 43.18,115.57 41.91,116.84 38.1,116.84 31.75,114.3 31.75,110.49 29.21,107.95 R19.1
N$28
  Bottom 0.406: 60.96,113.03 67.31,106.68 C4.1 | 60.96,113.03 Q7.3 | 60.96,113.03 58.42,109.22 C5.1 D41.C 41.91,100.33 39.37,100.33 31.75,105.41 R21.2
N$29
  Bottom 0.406: U$2.AH2 117.17,108.89 116.84,109.22 106.68,109.22 96.52,101.6 72.39,101.6 C4.2
N$30
  Bottom 0.406: U$2.AJ2 117.17,105.74 116.84,105.41 111.76,105.41 109.22,106.68 105.41,106.68 97.79,100.33 80.01,100.33 69.85,96.52 R23.1 | D44.C 58.42,99.06 C5.2 52.07,99.06 43.18,95.25 39.37,95.25 D43.A | D44.C R23.1 | D44.C R23.1
N$31
  Bottom 0.406: R23.2 69.85,95.25 64.77,91.44 62.23,91.44 58.42,93.98 Q9.2 49.53,93.98 43.18,91.44 38.1,91.44 27.94,95.25 R25.1
N$32  (via drill 0.81)
  Top 0.406: v86.36,99.06 v86.36,109.22
  Bottom 0.406: U$2.AE2 117.17,115.24 116.84,115.57 110.49,115.57 106.68,111.76 C6.1 | C6.1 R29.1 C6.1 | C6.1 101.6,113.03 93.98,113.03 v86.36,109.22 | R27.2 55.88,90.17 Q9.3 59.69,90.17 67.31,90.17 D44.A 76.2,93.98 v86.36,99.06 | v86.36,109.22 D46.A | v86.36,109.22 83.82,106.68 80.01,106.68 73.66,110.49 67.31,110.49 66.04,111.76 66.04,115.57 63.5,118.11 58.42,118.11 52.07,110.49 D49.C
N$33
  Bottom 0.406: C6.2 R29.2 86.36,104.14 67.31,104.14 64.77,106.68 62.23,106.68 60.96,105.41 Q11.2
N$34
  Bottom 0.406: U$2.AF2 117.12,112.04 116.84,111.76 110.49,111.76 104.14,109.22 96.52,102.87 66.04,102.87 Q11.3 63.5,101.6 62.23,100.33 59.69,100.33 58.42,101.6 D50.C 43.18,96.52 39.37,96.52 33.02,100.33 R31.2
N$35
  Bottom 0.406: R1.2 35.56,53.34 54.61,53.34 71.12,58.42 D1.C 78.74,58.42 81.28,55.88 D2.C
N$36
  Bottom 0.406: D2.A D3.C
N$37
  Bottom 0.406: D3.A Q1.2 54.61,52.07 36.83,52.07 30.48,48.26 R2.1
N$38
  Bottom 0.406: D19.A 81.28,49.53 64.77,49.53 Q1.3 59.69,50.8 57.15,50.8 50.8,44.45 | 50.8,44.45 D4.C | R3.2 30.48,45.72 35.56,49.53 44.45,49.53 50.8,44.45
N$39
  Bottom 0.406: D21.C D28.C D19.C 57.15,48.26 52.07,41.91 49.53,41.91 44.45,46.99 34.29,46.99 29.21,41.91 R5.2
N$40
  Bottom 0.406: D21.A D23.C
N$41
  Bottom 0.406: D23.A Q2.2 63.5,44.45 62.23,45.72 59.69,45.72 52.07,38.1 45.72,38.1 44.45,39.37 44.45,44.45 43.18,45.72 34.29,45.72 31.75,43.18 31.75,39.37 30.48,38.1 R6.1
N$42
  Bottom 0.406: 60.96,41.91 Q2.3 | 60.96,41.91 64.77,38.1 C1.1 | R8.2 36.83,31.75 39.37,29.21 41.91,29.21 D25.C C2.1 58.42,40.64 60.96,41.91
N$43
  Bottom 0.406: U$2.AK2 117.14,102.56 116.84,102.87 110.49,102.87 107.95,105.41 105.41,105.41 D38.A
N$44
  Bottom 0.406: U$2.AU2 116.84,77.47 110.49,77.47 107.95,80.01 104.14,80.01 101.6,76.2 96.52,64.77 90.17,57.15 90.17,27.94 88.9,26.67 85.09,26.67 78.74,31.75 74.93,31.75 73.66,30.48 C1.2
N$45
  Bottom 0.406: U$2.AV2 116.84,73.66 111.76,73.66 109.22,76.2 109.22,77.47 107.95,78.74 105.41,78.74 102.87,76.2 97.79,64.77 91.44,57.15 91.44,27.94 88.9,25.4 85.09,25.4 78.74,30.48 74.93,30.48 73.66,29.21 69.85,29.21 R10.1 D27.C C2.2 45.72,25.4 38.1,25.4 33.02,27.94 D26.A
N$46
  Bottom 0.406: R11.1 31.75,24.13 38.1,22.86 Q4.2 57.15,22.86 59.69,20.32 66.04,20.32 73.66,26.67 R10.2
N$47  (via drill 0.81)
  Top 0.406: v85.09,20.32 v85.09,30.48
  Bottom 0.406: U$2.AS2 116.84,83.82 105.41,83.82 102.87,82.55 100.33,80.01 99.06,76.2 93.98,64.77 87.63,57.15 87.63,46.99 D28.A 86.36,40.64 | D31.C 52.07,40.64 58.42,46.99 69.85,46.99 76.2,43.18 78.74,43.18 82.55,40.64 86.36,40.64 | R13.2 34.29,21.59 38.1,21.59 39.37,20.32 Q4.3 57.15,19.05 67.31,19.05 D27.A 77.47,20.32 v85.09,20.32 | v85.09,30.48 R15.1 | R15.1 86.36,39.37 86.36,40.64 | R15.1 C3.1
N$48
  Bottom 0.406: Q6.2 60.96,34.29 63.5,36.83 C3.2 R15.2
N$49
  Bottom 0.406: U$2.AT2 116.84,80.01 110.49,80.01 106.68,82.55 105.41,82.55 102.87,81.28 100.33,76.2 95.25,64.77 88.9,57.15 88.9,29.21 87.63,27.94 85.09,27.94 78.74,33.02 74.93,33.02 73.66,31.75 69.85,31.75 64.77,34.29 Q6.3 63.5,30.48 62.23,29.21 59.69,29.21 57.15,31.75 D34.C 44.45,26.67 38.1,26.67 33.02,30.48 R17.2
N$50
  Bottom 0.406: D39.C D38.C 82.55,95.25 64.77,87.63 30.48,87.63 R20.2
N$51
  Bottom 0.406: D39.A D40.C
N$52
  Bottom 0.406: D40.A Q8.2 74.93,90.17 64.77,86.36 35.56,86.36 30.48,83.82 R22.1
N$53
  Bottom 0.406: R24.2 36.83,85.09 44.45,85.09 D42.C 57.15,85.09 64.77,85.09 Q8.3 D45.A
N$54
  Bottom 0.406: D47.C D54.C D45.C 64.77,83.82 58.42,83.82 52.07,77.47 49.53,77.47 43.18,82.55 34.29,82.55 29.21,77.47 R26.2
N$55
  Bottom 0.406: D47.A D48.C
N$56
  Bottom 0.406: D48.A 68.58,77.47 Q10.2 63.5,80.01 62.23,81.28 59.69,81.28 53.34,73.66 46.99,73.66 44.45,76.2 44.45,78.74 41.91,81.28 35.56,81.28 31.75,77.47 31.75,74.93 30.48,73.66 R28.1
N$57
  Bottom 0.406: C7.1 63.5,74.93 60.96,77.47 Q10.3 54.61,73.66 C8.1 D51.C 41.91,64.77 39.37,64.77 33.02,71.12 R30.2
N$58
  Bottom 0.406: U$2.AN2 116.84,92.71 102.87,92.71 100.33,90.17 93.98,78.74 90.17,69.85 86.36,66.04 82.55,66.04 74.93,68.58 68.58,68.58 C7.2
N$59
  Bottom 0.406: U$2.AP2 116.84,90.17 110.49,90.17 109.22,91.44 104.14,91.44 97.79,83.82 91.44,68.58 86.36,64.77 81.28,64.77 77.47,66.04 71.12,66.04 R32.1 D53.C 59.69,63.5 C8.2 52.07,63.5 43.18,59.69 36.83,59.69 D52.A
N$60
  Bottom 0.406: R33.1 36.83,55.88 43.18,55.88 52.07,59.69 Q12.2 63.5,59.69 71.12,63.5 R32.2
N$61  (via drill 0.81)
  Top 0.406: v83.82,60.96 v83.82,71.12
  Bottom 0.406: U$2.AL2 116.84,99.06 110.49,99.06 102.87,96.52 91.44,86.36 88.9,85.09 R36.1 C9.1 D54.A 87.63,74.93 v83.82,71.12 73.66,74.93 69.85,78.74 63.5,82.55 58.42,82.55 53.34,76.2 D55.C | v83.82,60.96 D53.A 62.23,57.15 Q12.3 45.72,54.61 36.83,54.61 R34.2
N$62
  Bottom 0.406: R36.2 C9.2 91.44,78.74 87.63,71.12 85.09,68.58 82.55,68.58 73.66,72.39 63.5,72.39 60.96,69.85 Q13.2
N$63
  Bottom 0.406: U$2.AM2 116.84,96.52 110.49,96.52 104.14,95.25 99.06,90.17 92.71,78.74 90.17,72.39 87.63,68.58 86.36,67.31 82.55,67.31 74.93,69.85 Q13.3 63.5,66.04 62.23,64.77 59.69,64.77 58.42,66.04 D60.C 43.18,62.23 36.83,62.23 33.02,66.04 R37.2
N$65
  Bottom 0.813: D58.C D59.A
N$66
  Bottom 0.813: D57.C D58.A

### Text on the board
Bottom: DEVICE SELECTOR W103C | 3-69
200bmp: C:/Users/Vince/Documents/websvn/trunk/Eagle/projects/DEC/Wxxx/W103/W103Cbackfb.bmp